# Altium project actionneur-capteur1.PrjPCB
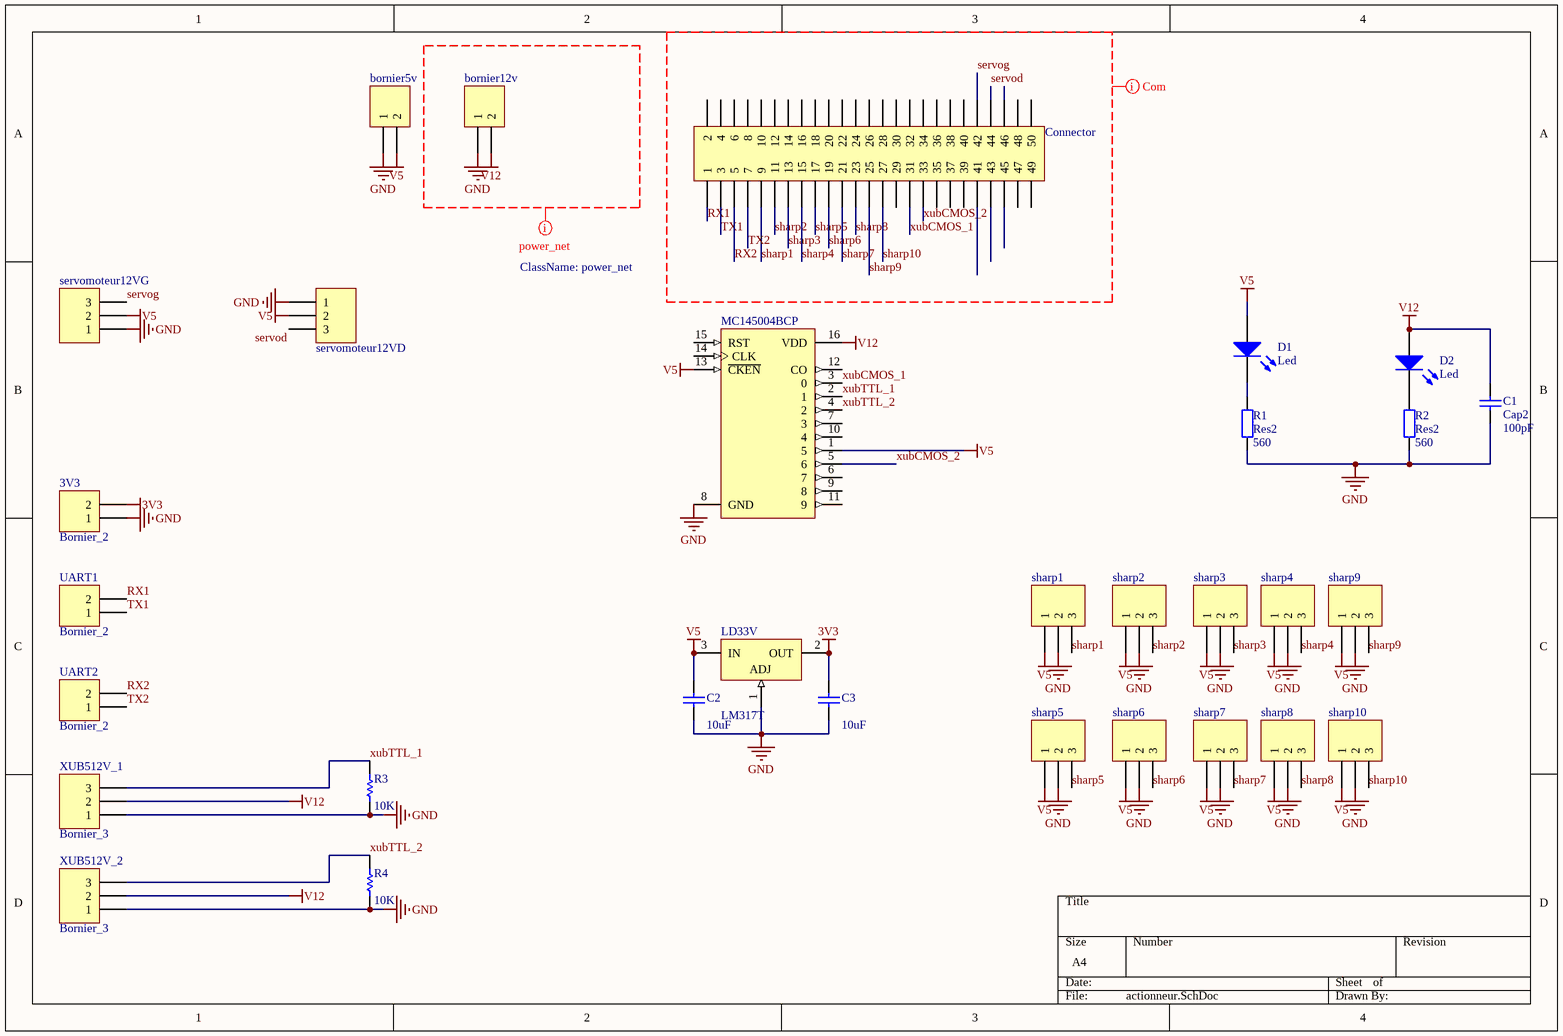
[diagram p0: actionneur.SchDoc]
1 sheet, 31 parts. Net scope: global (net labels, ports and power ports of the same name join across sheets).
Board file: PCB_actionneur2.PcbDoc

## Sheet actionneur.SchDoc
size A4

### Parts
3V3  Bornier_2  [Bornier_2]
bornier5v  Bornier_2  [Bornier_2]  (value not drawn)
bornier12v  Bornier_2  [Bornier_2]  (value not drawn)
C1  Cap2  value 100pF  [CAPA2]
C2  value 10uF  [CAPA2]  (hidden comment: Cap Semi)
C3  value 10uF  [CAPA2]  (hidden comment: Cap Semi)
Connector  Header 25X2  [HDR2X25]  (value not drawn)
D1  Led  [LED]
D2  Led  [LED]
LD33V  LM317T  [TO220]
MC145004BCP  CD4017BCN  [DIP16]  (value not drawn)
R1  Res2  value 560  [res5_1/4W]
R2  Res2  value 560  [res5_1/4W]
R3  value 10K  [AXIAL-0.5]  (hidden comment: Res Semi)
R4  value 10K  [AXIAL-0.5]  (hidden comment: Res Semi)
servomoteur12VD  Bornier_3  [Bornier_3]  (value not drawn)
servomoteur12VG  Bornier_3  [Bornier_3]  (value not drawn)
sharp1  Bornier_3  [HDR1X3]  (value not drawn)
sharp2  Bornier_3  [HDR1X3]  (value not drawn)
sharp3  Bornier_3  [HDR1X3]  (value not drawn)
sharp4  Bornier_3  [HDR1X3]  (value not drawn)
sharp5  Bornier_3  [HDR1X3]  (value not drawn)
sharp6  Bornier_3  [HDR1X3]  (value not drawn)
sharp7  Bornier_3  [HDR1X3]  (value not drawn)
sharp8  Bornier_3  [HDR1X3]  (value not drawn)
sharp9  Bornier_3  [HDR1X3]  (value not drawn)
sharp10  Bornier_3  [HDR1X3]  (value not drawn)
UART1  Bornier_2  [Bornier_2]
UART2  Bornier_2  [Bornier_2]
XUB512V_1  Bornier_3  [Bornier_3]
XUB512V_2  Bornier_3  [Bornier_3]

### Nets
3V3: 3V3.2 C3.2 LD33V.2(OUT)
GND: 3V3.1 bornier5v.1 bornier12v.1 C1.1 C2.1 C3.1 LD33V.1(ADJ) MC145004BCP.8(GND) R1.1 R2.1 R3.1 R4.1 servomoteur12VD.1 servomoteur12VG.1 sharp1.2 sharp2.2 sharp3.2 sharp4.2 sharp5.2 sharp6.2 sharp7.2 sharp8.2 sharp9.2 sharp10.2 XUB512V_1.1 XUB512V_2.1
V5: bornier5v.2 C2.2 D1.1(A) LD33V.3(IN) MC145004BCP.1(5) MC145004BCP.13(~{CKEN}) servomoteur12VD.2 servomoteur12VG.2 sharp1.1 sharp2.1 sharp3.1 sharp4.1 sharp5.1 sharp6.1 sharp7.1 sharp8.1 sharp9.1 sharp10.1
V12: bornier12v.2 C1.2 D2.1(A) MC145004BCP.16(VDD) XUB512V_1.2 XUB512V_2.2
RX1: Connector.1 UART1.2
RX2: Connector.5 UART2.2
servod: Connector.44 servomoteur12VD.3
servog: Connector.42 servomoteur12VG.3
sharp1: Connector.9 sharp1.3
sharp2: Connector.11 sharp2.3
sharp3: Connector.13 sharp3.3
sharp4: Connector.15 sharp4.3
sharp5: Connector.17 sharp5.3
sharp6: Connector.19 sharp6.3
sharp7: Connector.21 sharp7.3
sharp8: Connector.23 sharp8.3
sharp9: Connector.25 sharp9.3
sharp10: Connector.27 sharp10.3
TX1: Connector.3 UART1.1
TX2: Connector.7 UART2.1
xubCMOS_1: Connector.31 MC145004BCP.3(0)
xubCMOS_2: Connector.33 MC145004BCP.5(6)
xubTTL_1: MC145004BCP.2(1) R3.2 XUB512V_1.3
xubTTL_2: MC145004BCP.4(2) R4.2 XUB512V_2.3
NetD1_2: D1.2(K) R1.2
NetD2_2: D2.2(K) R2.2

Not connected (* = marked no-connect by the designer): Connector 2 4 6 8 10 12 14 16 18 20 22 24 26 28 29 30 32 34 35 36 37 38 39 40 41 43 45 46 47 48 49 50; MC145004BCP 6(7) 7(3) 9(8) 10(4) 11(9) 12(CO) 14(CLK) 15(RST)

### Layout directives
net class power_net: GND, V12
net class com_net: RX1, RX2, servod, servog, sharp1, sharp2, sharp3, sharp4, sharp5, sharp6, sharp7, sharp8, sharp9, sharp10, TX1, TX2, xubCMOS_1, xubCMOS_2

### Library data of the parts
3V3 bornier5v bornier12v UART1 UART2 = Bornier_2: Header, 2-Pin; LatestRevisionDate: 17-Jul-2002; LatestRevisionNote: Re-released for DXP Platform.; Publisher: Altium Limited
C1 = Cap2: Capacitor; Published: 8-Jun-2000; LatestRevisionDate: 17-Jul-2002; LatestRevisionNote: Re-released for DXP Platform.; PackageReference: RAD-0.3; Publisher: Altium Limited
C2 C3 = Cap Semi: Capacitor (Semiconductor SIM Model); Published: 8-Jun-2000; LatestRevisionDate: 29-May-2009; LatestRevisionNote: IPC-7351 Footprint Added.; PackageReference: C1206; Publisher: Altium Limited; PackageDescription: Chip Capacitor
Connector = Header 25X2: Header, 25-Pin, Dual row; LatestRevisionDate: 17-Jul-2002; LatestRevisionNote: Re-released for DXP Platform.; Publisher: Altium Limited
LD33V = LM317T: 3-Terminal Adjustable Regulator; Published: 15-Apr-2002; DatasheetVersion: Aug-1999; PackageVersion: 1995; PackageReference: T03B; Publisher: Altium Limited; PackageDescription: TO, Thru-Hole, Vertical, Heatsink Mounted; 3 In-Line Leads; Pitch 2.54 mm; ComponentLink1Description: Manufacturer Link; ComponentLink1URL: http://www.national.com/; ComponentLink2Description: Datasheet; ComponentLink2URL: http://www.national.com/ds.cgi/LM/LM117.pdf; ComponentLink3Description: URL Link1; ComponentLink3URL: http://www.national.com/pf/LM/LM317.html
MC145004BCP = CD4017BCN: Decade Counter/Divider with 10 Decoded Outputs; Published: 17-Jul-2002; LatestRevisionDate: 04-Mar-2005; LatestRevisionNote: Stylized 3D Model Added.; DatasheetVersion: Jan-1999; PackageVersion: 2000; PackageReference: N16E; Publisher: Altium Limited; PackageDescription: DIP; 16 Leads; Row Spacing 7.62 mm; Pitch 2.54 mm; ComponentLink1Description: Manufacturer Link; ComponentLink1URL: http://www.fairchildsemi.com/; ComponentLink2Description: Datasheet; ComponentLink2URL: http://www.fairchildsemi.com/ds/CD%2FCD4017BC.pdf
R1 R2 = Res2: Resistor; Published: 8-Jun-2000; LatestRevisionDate: 17-Jul-2002; LatestRevisionNote: Re-released for DXP Platform.; PackageReference: AXIAL-0.4; Publisher: Altium Limited
R3 R4 = Res Semi: Semiconductor Resistor; Published: 8-Jun-2000; LatestRevisionDate: 17-Jul-2002; LatestRevisionNote: Re-released for DXP Platform.; PackageReference: AXIAL-0.5; Publisher: Altium Limited; PackageDescription: Axial Device, Thru-Hole; 2 Leads; 0.5 in Pin Spacing
servomoteur12VD servomoteur12VG sharp1-sharp10 XUB512V_1 XUB512V_2 = Bornier_3: Header, 3-Pin; LatestRevisionDate: 17-Jul-2002; LatestRevisionNote: Re-released for DXP Platform.; Publisher: Altium Limited
D1 D2 = Led: Published: 8-Jun-2000; LatestRevisionDate: 17-Jul-2002; LatestRevisionNote: Re-released for DXP Platform.; DatasheetDocument: 1998; PackageDocument: Aug-1999; PackageReference: DO-41; Publisher: Altium Limited; Code_JEDEC: DO-204-AL; ComponentLink1Description: Manufacturer Link; ComponentLink1URL: http://www.fairchildsemi.com/; ComponentLink2Description: Datasheet; ComponentLink2URL: http://www.fairchildsemi.com/ds/1N%2F1N4001.pdf